# EAGLE design connector_cable_rev1 (EAGLE 9.3.0)
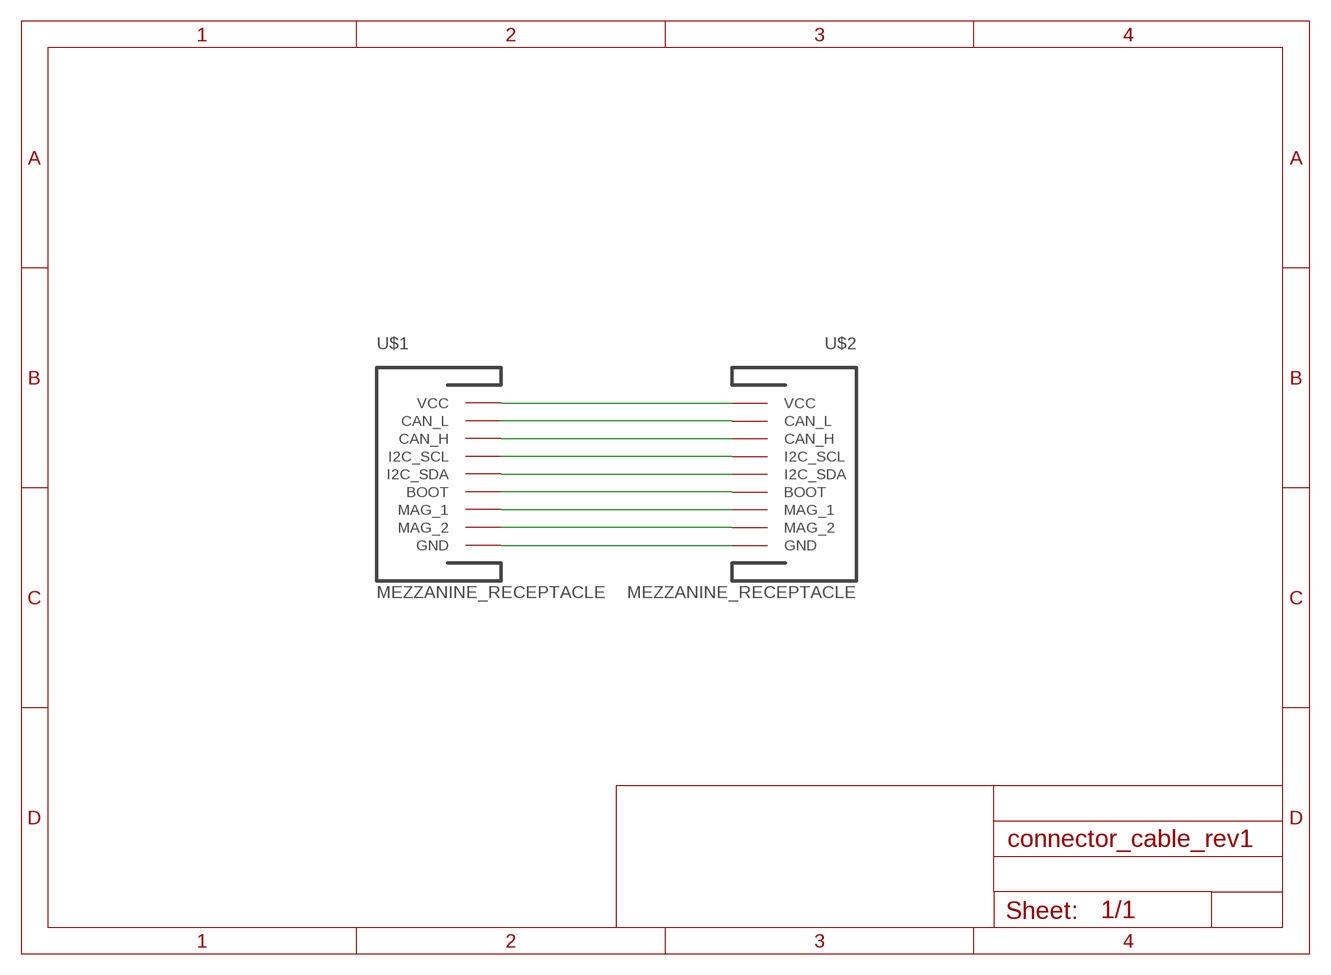
[diagram p0: schematic, sheet 1]

## Parts
U$1  MEZZANINE_RECEPTACLE  [MEZZANINE_RECEPTACLE]
U$2  MEZZANINE_RECEPTACLE  [MEZZANINE_RECEPTACLE]

## Nets
BOOT: U$1.P$9(BOOT) U$1.P$22(BOOT) U$2.P$9(BOOT) U$2.P$22(BOOT)
CAN_H: U$1.P$6(CAN_H) U$1.P$25(CAN_H) U$2.P$6(CAN_H) U$2.P$25(CAN_H)
CAN_L: U$1.P$5(CAN_L) U$1.P$26(CAN_L) U$2.P$5(CAN_L) U$2.P$26(CAN_L)
GND: U$1.P$1(GND) U$1.P$2(GND) U$1.P$14(GND) U$1.P$15(GND) U$1.P$16(GND) U$1.P$17(GND) U$1.P$29(GND) U$1.P$30(GND) U$2.P$1(GND) U$2.P$2(GND) U$2.P$14(GND) U$2.P$15(GND) U$2.P$16(GND) U$2.P$17(GND) U$2.P$29(GND) U$2.P$30(GND)
MAG1: U$1.P$10(MAG_1) U$1.P$21(MAG_1) U$2.P$10(MAG_1) U$2.P$21(MAG_1)
MAG2: U$1.P$11(MAG_2) U$1.P$20(MAG_2) U$2.P$11(MAG_2) U$2.P$20(MAG_2)
SCL: U$1.P$7(I2C_SCL) U$1.P$24(I2C_SCL) U$2.P$7(I2C_SCL) U$2.P$24(I2C_SCL)
SDA: U$1.P$8(I2C_SDA) U$1.P$23(I2C_SDA) U$2.P$8(I2C_SDA) U$2.P$23(I2C_SDA)
VCC: U$1.P$3(VCC) U$1.P$4(VCC) U$1.P$12(VCC) U$1.P$13(VCC) U$1.P$18(VCC) U$1.P$19(VCC) U$1.P$27(VCC) U$1.P$28(VCC) U$2.P$3(VCC) U$2.P$4(VCC) U$2.P$12(VCC) U$2.P$13(VCC) U$2.P$18(VCC) U$2.P$19(VCC) U$2.P$27(VCC) U$2.P$28(VCC)

## Library data of the parts
U$1 U$2 = oresat-ACS_driver_board:MEZZANINE_RECEPTACLE

## Board
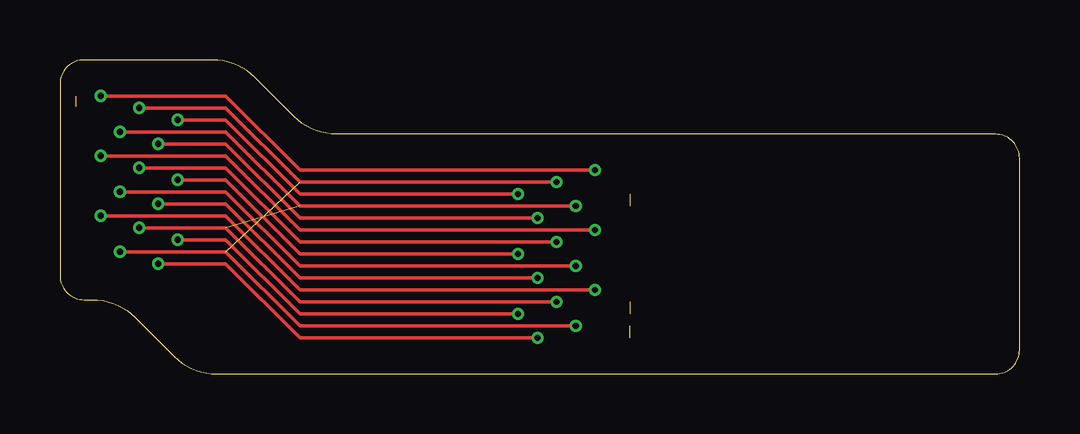
[diagram p1: board, top side]
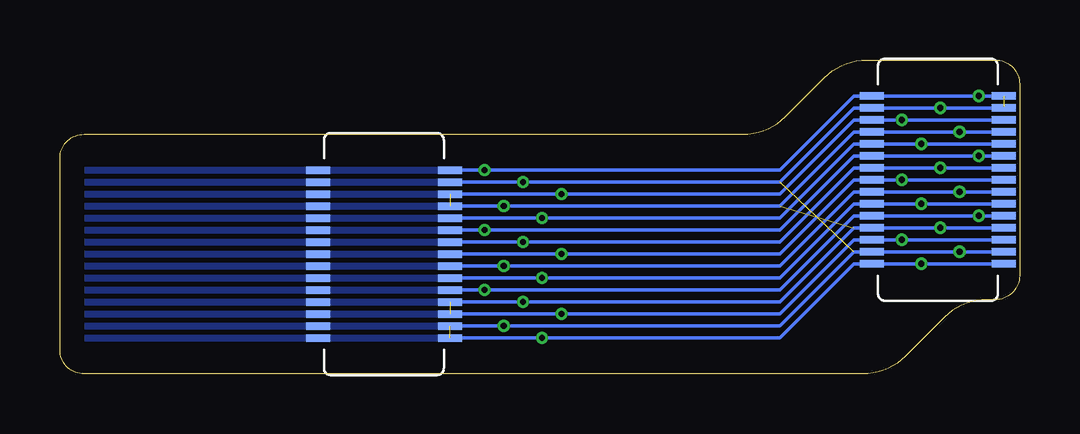
[diagram p2: board, bottom side, seen from below]

Size 40 x 13.1 mm. Coordinates in mm from the lower left corner, seen from the top.
Outline: 1,3.1 1.36,3.1 arc-45 3.13,2.37 4.77,0.73 arc45 6.54,0 39,0 arc90 40,1 40,9 arc90 39,10 11.54,10 arc-45 9.77,10.73 8.13,12.37 arc45 6.36,13.1 1,13.1 arc90 0,12.1 0,4.1 arc90 1,3.1
Copper layers (1*16): Top 0.035559375mm / dielectric 4mil / Bottom 0.035559375mm
Design rules "default *": minimum track width 6mil, minimum drill 10mil, track to track 6mil, track to pad 6mil, pad to pad 6mil, via to via 6mil, smd to smd 6mil, copper to edge 40mil, drill to drill 6mil, minimum pad ring 5mil, minimum via ring 5mil, stop-mask expansion 4mil, vias tented up to drill 15mil, thermal gap 10mil

### Footprints (pad centres in the part's own frame; a part is rotated, then mirrored left to right if it is on the bottom)
MEZZANINE_RECEPTACLE = smd 0.3 x 1: P$1 -3.5,2.75; P$2 -3,2.75; P$3 -2.5,2.75; P$4 -2,2.75; P$5 -1.5,2.75; P$6 -1,2.75; P$7 -0.5,2.75; P$8 0,2.75; P$9 0.5,2.75; P$10 1,2.75; P$11 1.5,2.75; P$12 2,2.75; P$13 2.5,2.75; P$14 3,2.75; P$15 3.5,2.75; P$16 3.5,-2.75; P$17 3,-2.75; P$18 2.5,-2.75; P$19 2,-2.75; P$20 1.5,-2.75; P$21 1,-2.75; P$22 0.5,-2.75; P$23 0,-2.75; P$24 -0.5,-2.75; P$25 -1,-2.75; P$26 -1.5,-2.75; P$27 -2,-2.75; P$28 -2.5,-2.75; P$29 -3,-2.75; P$30 -3.5,-2.75

### Placement (x,y rotation side)
U$1  3.4,8.1 90 bottom
U$2  26.5,5 90 bottom

### Tracks (layer width: path | path; a pad name or v marks a point on that pad's centre or on a via)
BOOT  (via drill 0.25)
  Top 0.152: v3.3,8.6 6.9,8.6 10,5.5 v20.7,5.5
  Bottom 0.152: U$2.P$22 v20.7,5.5 10,5.5 6.9,8.6 U$1.P$9 v3.3,8.6 U$1.P$22
  pour Bottom (no thermals): 23.3,5.6 23.3,5.4 40,5.4 40,5.6
CAN_H  (via drill 0.25)
  Top 0.152: v4.1,7.1 6.9,7.1 10,4 v19.9,4
  Bottom 0.152: U$2.P$25 v19.9,4 10,4 6.9,7.1 U$1.P$6 v4.1,7.1 U$1.P$25
  pour Bottom (no thermals): 23.3,4.1 23.3,3.9 40,3.9 40,4.1
CAN_L  (via drill 0.25)
  Top 0.152: v1.7,6.6 6.9,6.6 10,3.5 v22.3,3.5
  Bottom 0.152: U$2.P$26 v22.3,3.5 10,3.5 6.9,6.6 U$1.P$5 v1.7,6.6 U$1.P$26
  pour Bottom (no thermals): 23.3,3.6 23.3,3.4 40,3.4 40,3.6
GND  (via drill 0.25)  (3 unrouted)
  Top 0.152: v1.7,11.6 6.9,11.6 10,8.5 v22.3,8.5 | v3.3,11.1 6.9,11.1 10,8 v20.7,8 | v2.5,5.1 6.9,5.1 10,2 v21.5,2 | v4.1,4.6 6.9,4.6 10,1.5 v19.9,1.5
  Bottom 0.152: U$2.P$30 v19.9,1.5 10,1.5 6.9,4.6 U$1.P$1 v4.1,4.6 U$1.P$30 | U$2.P$29 v21.5,2 10,2 6.9,5.1 U$1.P$2 v2.5,5.1 U$1.P$29 | U$2.P$17 v20.7,8 10,8 6.9,11.1 U$1.P$14 v3.3,11.1 U$1.P$17 0.65,11.16 | U$2.P$16 v22.3,8.5 10,8.5 6.9,11.6 U$1.P$15 v1.7,11.6 U$1.P$16
  pour Bottom (no thermals): 23.3,8.6 23.3,8.4 40,8.4 40,8.6
  pour Bottom (no thermals): 23.3,1.6 23.3,1.4 40,1.4 40,1.6
  pour Bottom (no thermals): 23.3,2.1 23.3,1.9 40,1.9 40,2.1
  pour Bottom (no thermals): 23.3,8.1 23.3,7.9 40,7.9 40,8.1
MAG1  (via drill 0.25)
  Top 0.152: v1.7,9.1 6.9,9.1 10,6 v22.3,6
  Bottom 0.152: U$2.P$21 v22.3,6 10,6 6.9,9.1 U$1.P$10 v1.7,9.1 U$1.P$21
  pour Bottom (no thermals): 23.3,6.1 23.3,5.9 40,5.9 40,6.1
MAG2  (via drill 0.25)
  Top 0.152: v4.1,9.6 6.9,9.6 10,6.5 v19.9,6.5
  Bottom 0.152: U$2.P$20 v19.9,6.5 10,6.5 6.9,9.6 U$1.P$11 v4.1,9.6 U$1.P$20
  pour Bottom (no thermals): 23.3,6.6 23.3,6.4 40,6.4 40,6.6
SCL  (via drill 0.25)
  Top 0.152: v2.5,7.6 6.9,7.6 10,4.5 v21.5,4.5
  Bottom 0.152: U$2.P$24 v21.5,4.5 10,4.5 6.9,7.6 U$1.P$7 v2.5,7.6 U$1.P$24
  pour Bottom (no thermals): 23.3,4.6 23.3,4.4 40,4.4 40,4.6
SDA  (via drill 0.25)
  Top 0.152: v4.9,8.1 6.9,8.1 10,5 v19.1,5
  Bottom 0.152: U$2.P$23 v19.1,5 10,5 6.9,8.1 U$1.P$8 v4.9,8.1 U$1.P$23
  pour Bottom (no thermals): 23.3,5.1 23.3,4.9 40,4.9 40,5.1
VCC  (via drill 0.25)  (3 unrouted)
  Top 0.152: v4.9,10.6 6.9,10.6 10,7.5 v19.1,7.5 | v2.5,10.1 6.9,10.1 10,7 v21.5,7 | v3.3,6.1 6.9,6.1 10,3 v20.7,3 | v4.9,5.6 6.9,5.6 10,2.5 v19.1,2.5
  Bottom 0.152: U$2.P$27 v20.7,3 10,3 6.9,6.1 U$1.P$4 v3.3,6.1 U$1.P$27 | U$2.P$28 v19.1,2.5 10,2.5 6.9,5.6 U$1.P$3 v4.9,5.6 U$1.P$28 | U$2.P$19 v21.5,7 10,7 6.9,10.1 U$1.P$12 v2.5,10.1 U$1.P$19 | U$2.P$18 v19.1,7.5 10,7.5 6.9,10.6 U$1.P$13 v4.9,10.6 U$1.P$18
  pour Bottom (no thermals): 23.3,7.6 23.3,7.4 40,7.4 40,7.6
  pour Bottom (no thermals): 23.3,7.1 23.3,6.9 40,6.9 40,7.1
  pour Bottom (no thermals): 23.3,3.1 23.3,2.9 40,2.9 40,3.1
  pour Bottom (no thermals): 23.3,2.6 23.3,2.4 40,2.4 40,2.6